# EAGLE design food_dispenser (EAGLE 9.6.2)
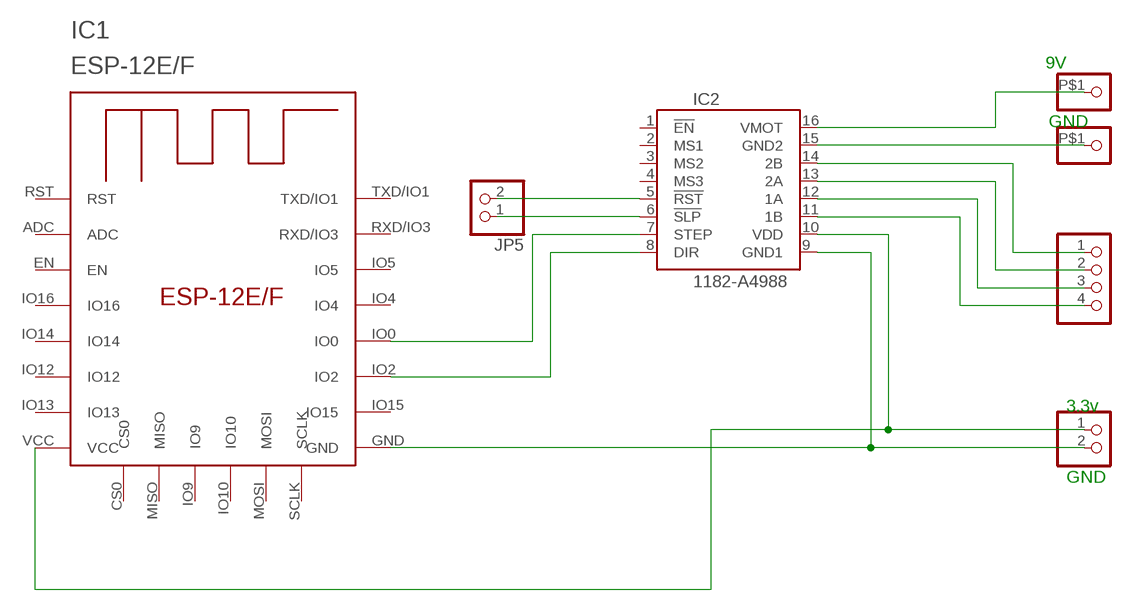
[diagram p0: schematic, sheet 1]

## Parts
IC1  ESP-12E/F  [ESP-12E]
IC2  1182-A4988  [A4988]
JP1  PINHD-1X1-BIGPOGO  [1X1-BIGPOGO]
JP2  PINHD-1X1-BIGPOGO  [1X1-BIGPOGO]
JP3  PINHD-1X2  [1X02]
JP4  PINHD-1X4  [1X04]
JP5  PINHD-1X2  [1X02]

## Nets
GND: IC1.GND IC2.9(GND1) JP3.2
N$1: IC2.15(GND2) JP2.P$1
N$2: IC2.16(VMOT) JP1.P$1
N$3: IC2.6(!SLP) JP5.1
N$5: IC1.VCC IC2.10(VDD) JP3.1
N$6: IC2.14(2B) JP4.1
N$7: IC2.13(2A) JP4.2
N$8: IC2.12(1A) JP4.3
N$9: IC2.11(1B) JP4.4
N$10: IC1.IO0 IC2.7(STEP)
N$11: IC1.IO2 IC2.8(DIR)
N$12: IC2.5(!RST) JP5.2
Unconnected: IC1.ADC IC1.CS0 IC1.EN IC1.IO4 IC1.IO5 IC1.IO9 IC1.IO10 IC1.IO12 IC1.IO13 IC1.IO14 IC1.IO15 IC1.IO16 IC1.MISO IC1.MOSI IC1.RST IC1.RXD/IO3 IC1.SCLK IC1.TXD/IO1 IC2.1(!EN) IC2.2(MS1) IC2.3(MS2) IC2.4(MS3)

## Notes on the sheet
- 9V
- GND
- 3.3v
- GND

## Library data of the parts
IC1 = esp-12e-f:ESP-12E/F
IC2 = pololu-stepper-driver:1182-A4988: A4988 Stepper Motor Driver Carrier #1182 A4988 Stepper Motor Driver Carrier <https://www.pololu.com/product/1182> in Japan, Suzaku Lab. Ltd. <https://suzakugiken.jp/> #1182 A4988ステッピングモータドライバ <https://szc.jp/po1182>
JP1 JP2 = adafruit:PINHD-1X1: Pin header 1x1 for 0.1" spacing With round pins
JP3 JP5 = pinhead:PINHD-1X2: PIN HEADER
JP4 = pinhead:PINHD-1X4: PIN HEADER

## Board
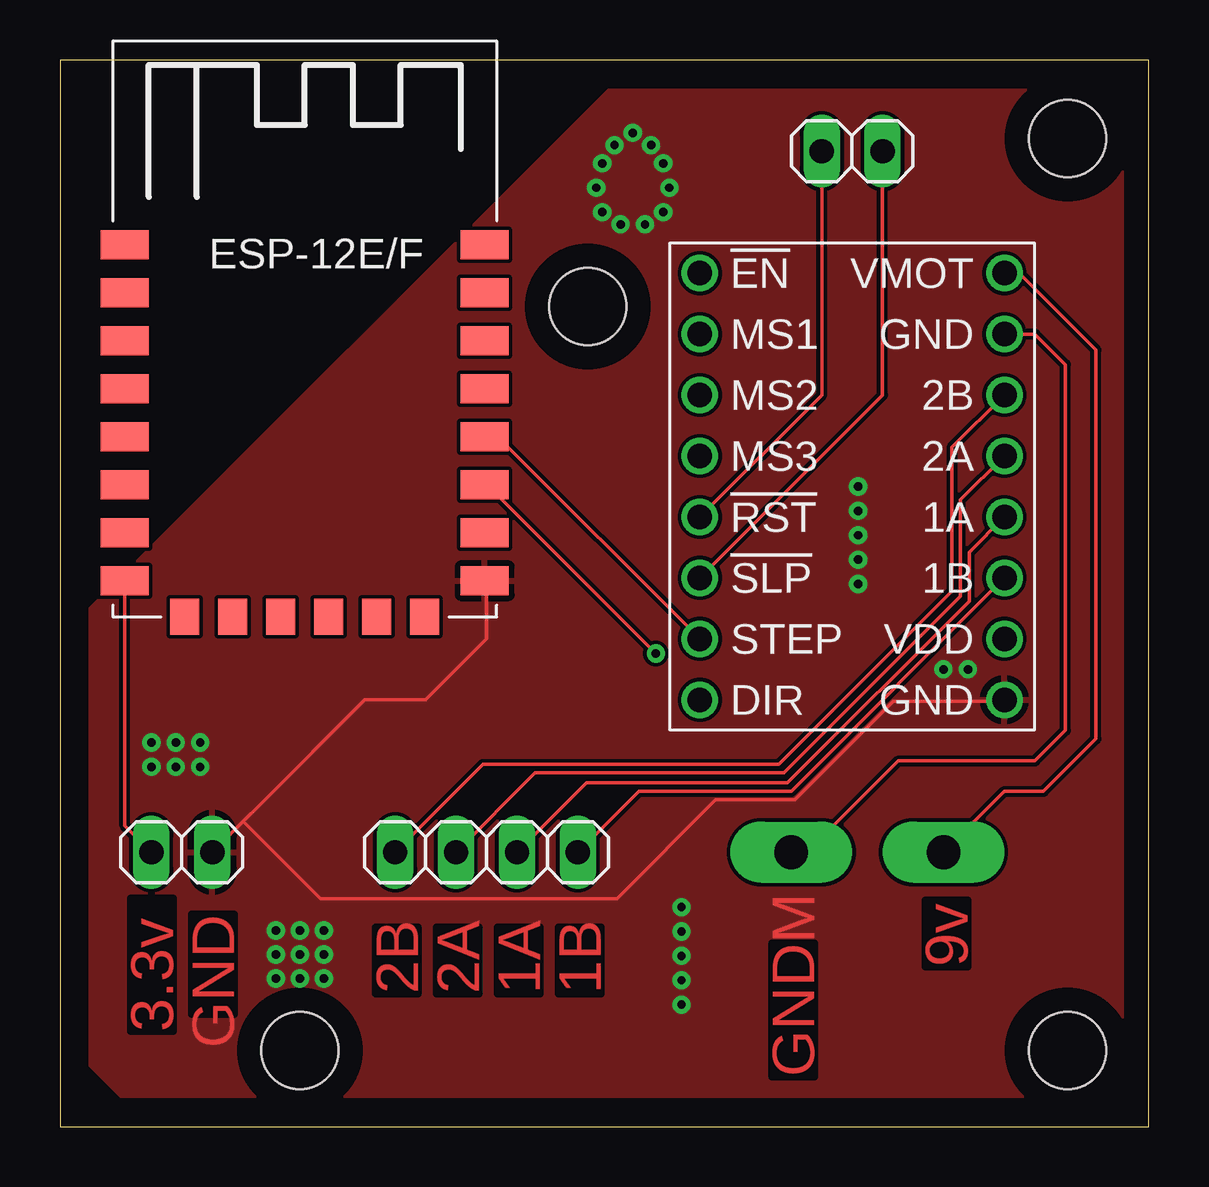
[diagram p1: board, top side]
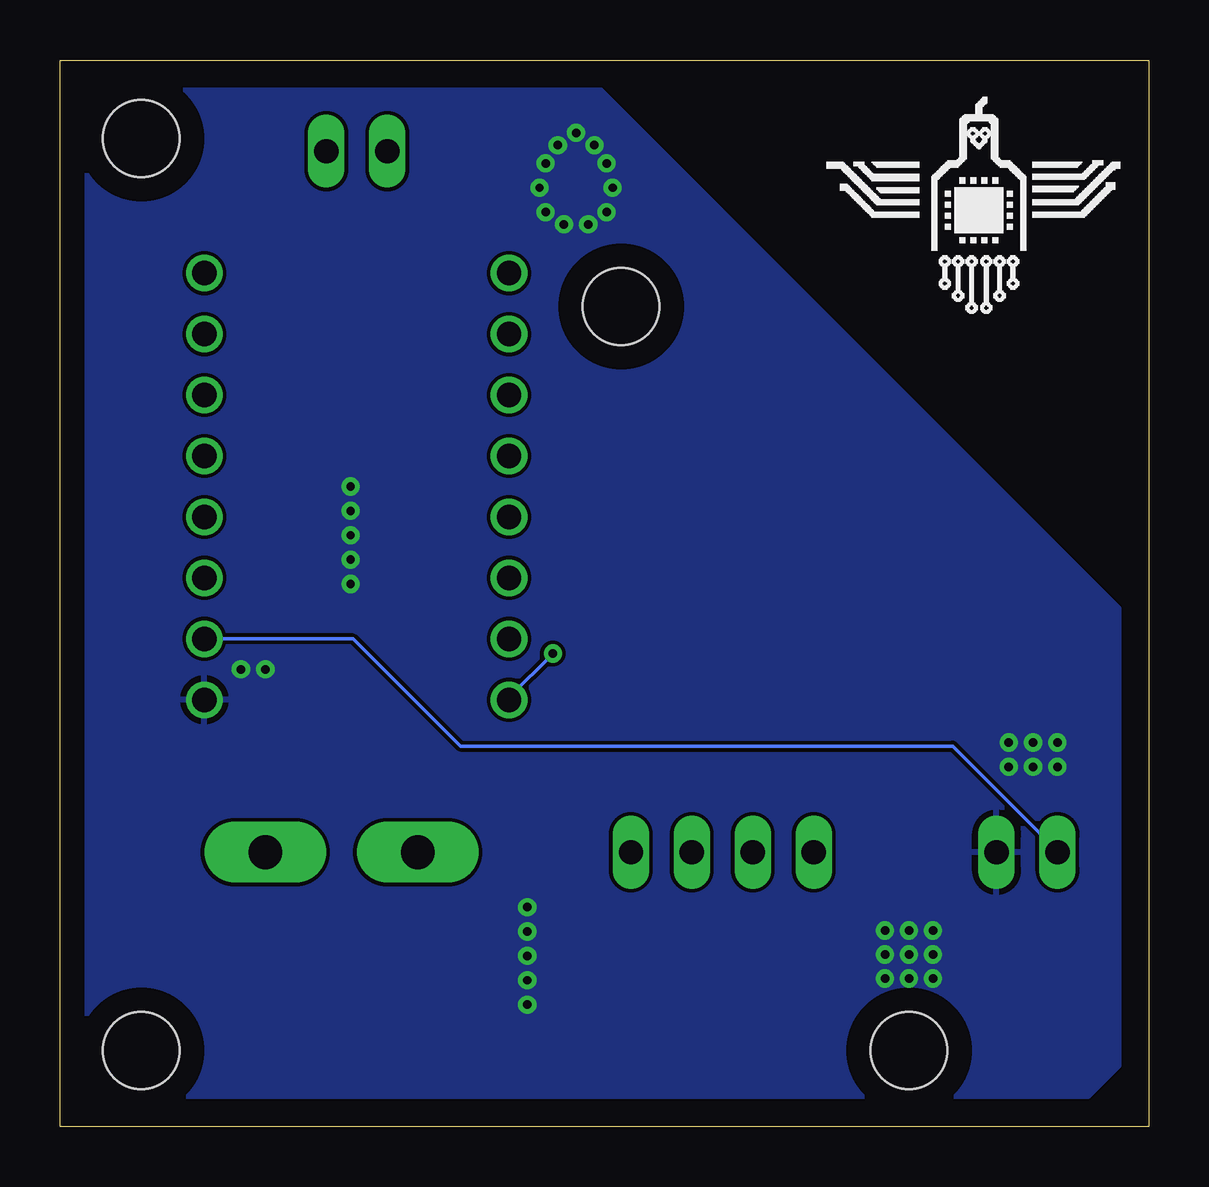
[diagram p2: board, bottom side, seen from below]

Size 45.39 x 44.44 mm. Coordinates in mm from the lower left corner, seen from the top.
Outline: 0,0 45.39,0 45.39,44.44 0,44.44 0,0
Copper layers (1*16): Top 0.035mm / dielectric 1.5mm / Bottom 0.035mm
Design rules "default": minimum track width 6mil, minimum drill 0.35mm, track to track 6mil, track to pad 6mil, pad to pad 6mil, via to via 6mil, smd to smd 6mil, copper to edge 40mil, drill to drill 6mil, minimum pad ring 10mil, minimum via ring 8mil, stop-mask expansion 4mil, vias tented up to drill 0mil, thermal gap 10mil
Holes 3.2 mm at 22,34.17 42,41.17 42,3.17 10,3.17

### Footprints (pad centres in the part's own frame; a part is rotated, then mirrored left to right if it is on the bottom)
ESP-12E = smd 2 x 1.2: ADC -7.46,5.53; EN -7.46,3.53; GND 7.54,-6.47; IO0 7.54,-0.47; IO2 7.54,-2.47; IO4 7.54,1.53; IO5 7.54,3.53; IO12 -7.46,-2.47; IO13 -7.46,-4.47; IO14 -7.46,-0.47; IO15 7.54,-4.47; IO16 -7.46,1.53; RST -7.46,7.53; RXD/IO3 7.54,5.53; TXD/IO1 7.54,7.53; VCC -7.46,-6.47 | smd 1.2 x 1.5: CS0 -4.96,-7.97; IO9 -0.96,-7.97; IO10 1.04,-7.97; MISO -2.96,-7.97; MOSI 3.04,-7.97; SCLK 5.04,-7.97
A4988 = drill 1.016: 1 -6.35,8.89; 2 -6.35,6.35; 3 -6.35,3.81; 4 -6.35,1.27; 5 -6.35,-1.27; 6 -6.35,-3.81; 7 -6.35,-6.35; 8 -6.35,-8.89; 9 6.35,-8.89; 10 6.35,-6.35; 11 6.35,-3.81; 12 6.35,-1.27; 13 6.35,1.27; 14 6.35,3.81; 15 6.35,6.35; 16 6.35,8.89
1X1-BIGPOGO = drill 1.4 pad 2.54 long: P$1 0,0
1X02 = drill 1.016 long: 1 -1.27,0; 2 1.27,0
1X04 = drill 1.016 long: 1 -3.81,0; 2 -1.27,0; 3 1.27,0; 4 3.81,0

### Placement (x,y rotation side)
IC1  10.16,29.21 0 top
IC2  33.02,26.67 0 top
JP1  36.83,11.43 0 top
JP2  30.48,11.43 0 top
JP3  5.08,11.43 0 top
JP4  17.78,11.43 0 top
JP5  33.02,40.64 180 top

### Tracks (layer width: path | path; a pad name or v marks a point on that pad's centre or on a via)
GND  (via drill 0.35)
  Top 0.152: JP3.2 7.64,12.73 | 7.64,12.73 8.36,13.44 12.7,17.78 15.24,17.78 16.51,19.05 17.78,20.32 17.78,22.66 IC1.GND | 7.64,12.73 10.87,9.5 23.22,9.5 27.33,13.61 30.63,13.61 34.75,17.73 39.32,17.73 IC2.9
  other vias: 5.84,14.99 4.83,14.99 3.81,14.99 5.84,16 4.83,16 3.81,16 9,6.17 10,6.17 11,6.17 11,7.17 10,7.17 9,7.17 9,8.17 10,8.17 11,8.17 25.91,5.08 25.91,6.1 25.91,7.11 25.91,8.13 25.91,9.14 33.27,22.61 33.27,23.62 33.27,24.64 33.27,25.65 33.27,26.67 36.83,19.05 37.85,19.05 23.37,37.59 22.61,38.1 22.35,39.12 24.38,37.59 25.15,38.1 25.4,39.12 25.15,40.13 22.61,40.13 23.11,40.89 23.88,41.4 24.64,40.89
  pour Bottom: 2.54,1.27 43.18,1.27 44.45,2.54 44.45,41.91 43.18,43.18 22.86,43.18 1.27,21.59 1.27,2.54
  pour Top: 1.27,2.54 2.54,1.27 43.18,1.27 44.45,2.54 44.45,41.91 43.18,43.18 22.86,43.18 1.27,21.59
N$1
  Top 0.152: JP2.P$1 31.14,11.43 34.95,15.24 40.64,15.24 41.91,16.51 41.91,31.75 40.64,33.02 IC2.15
N$2
  Top 0.152: JP1.P$1 39.37,13.97 41,13.97 43.18,16.15 43.18,32.36 39.98,35.56 IC2.16
N$3
  Top 0.152: IC2.6 34.29,30.48 JP5.1
N$5
  Top 0.152: JP3.1 2.7,12.54 IC1.VCC
  Bottom 0.152: IC2.10 33.17,20.32 28.7,15.85 8.18,15.85 5.33,13.01 3.81,11.48 JP3.1
N$6
  Top 0.152: JP4.1 17.63,15.09 29.97,15.09 37.19,22.3 37.19,28.3 IC2.14
N$7
  Top 0.152: JP4.2 19.81,14.73 30.18,14.73 37.54,22.1 37.54,26.11 IC2.13
N$8
  Top 0.152: JP4.3 21.95,14.33 30.33,14.33 37.9,21.9 37.9,23.93 IC2.12
N$9
  Top 0.152: JP4.4 24.13,13.97 30.48,13.97 IC2.11
N$10
  Top 0.152: IC2.7 18.29,28.7 17.83,28.7 IC1.IO0
N$11  (via drill 0.35)
  Top 0.152: v24.84,19.71 17.83,26.72 IC1.IO2
  Bottom 0.152: v24.84,19.71 26.67,17.88 IC2.8
N$12
  Top 0.152: IC2.5 31.75,30.48 JP5.2

### Text on the board
Top: GND | 9v | 2B | 2A | 1A | 1B | 3.3v | GNDM